# Altium schematic sheet MCU.SchDoc
size A4; SheetNumber: 4; SheetTotal: 5
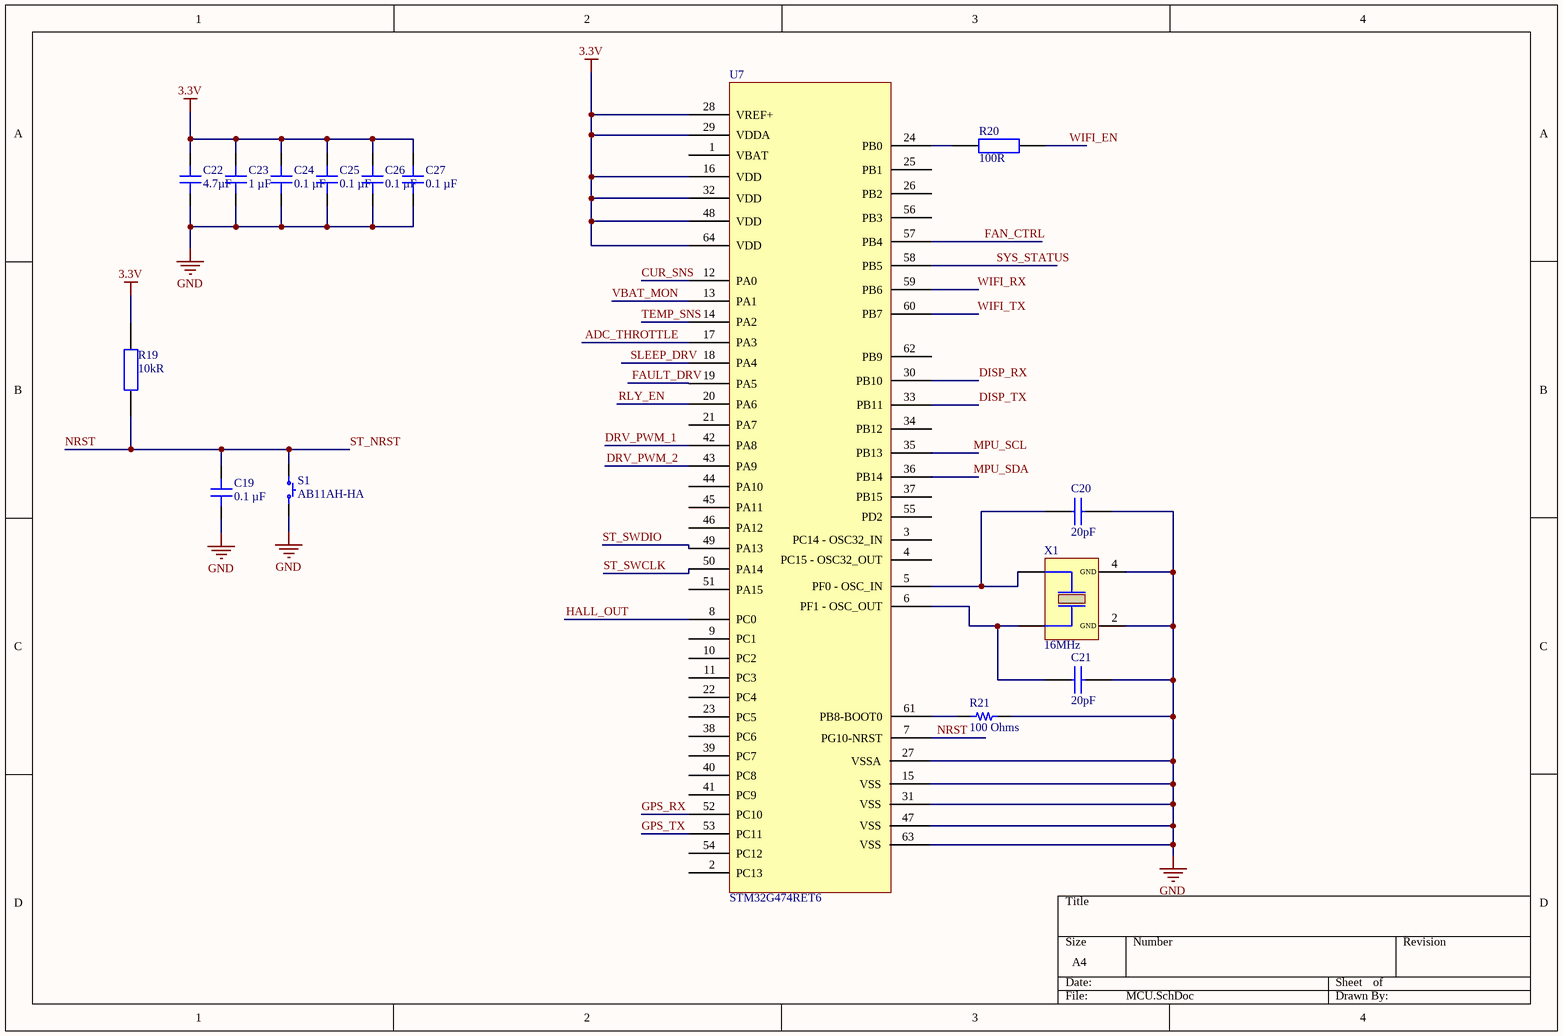
[diagram p0: MCU.SchDoc]

## Parts
C19  0.1 µF  [CAP 0603_1608]
C20  Capacitance: 20pF  [CAP_0603]  (hidden comment: CL10C200JB8NNNC)
C21  Capacitance: 20pF  [CAP_0603]  (hidden comment: CL10C200JB8NNNC)
C22  4.7µF  [CAP 0805_2012]
C23  1 µF  [CAP 0805_2012]
C24  0.1 µF  [CAP 0603_1608]
C25  0.1 µF  [CAP 0603_1608]
C26  0.1 µF  [CAP 0603_1608]
C27  0.1 µF  [CAP 0603_1608]
R19  Resistance: 10kR  [RES_0603]  (hidden comment: RC0603FR-0710KL)
R20  Resistance: 100R  [RES_0603]  (hidden comment: RC0603JR-07100RL)
R21  100 Ohms  [RES 0603_1608]
S1  AB11AH-HA  [NKK AB11AH-HA]
U7  STM32G474RET6  [STM32G474RET6]
X1  Frequency: 16MHz  [ECS]  (hidden comment: ECS-160-20-30B-TR)

## Nets
3.3V: C22.2 C23.2 C24.2 C25.2 C26.2 C27.2 R19.2 U7.16(VDD) U7.28(VREF+) U7.29(VDDA) U7.32(VDD) U7.48(VDD) U7.64(VDD)
GND: C19.1 C20.2 C21.2 C22.1 C23.1 C24.1 C25.1 C26.1 C27.1 R21.2 S1.3 U7.15(VSS) U7.27(VSSA) U7.31(VSS) U7.47(VSS) U7.63(VSS) X1.2(GND) X1.4(GND)
ADC_THROTTLE: U7.17(PA3)
CUR_SNS: U7.12(PA0)
DISP_RX: U7.30(PB10)
DISP_TX: U7.33(PB11)
DRV_PWM_1: U7.42(PA8)
DRV_PWM_2: U7.43(PA9)
FAN_CTRL: U7.57(PB4)
FAULT_DRV: U7.19(PA5)
GPS_RX: U7.52(PC10)
GPS_TX: U7.53(PC11)
HALL_OUT: U7.8(PC0)
MPU_SCL: U7.35(PB13)
MPU_SDA: U7.36(PB14)
NRST: C19.2 R19.1 S1.1 U7.7(PG10-NRST)  [also labelled ST_NRST]
RLY_EN: U7.20(PA6)
SLEEP_DRV: U7.18(PA4)
ST_SWCLK: U7.50(PA14)
ST_SWDIO: U7.49(PA13)
SYS_STATUS: U7.58(PB5)
TEMP_SNS: U7.14(PA2)
VBAT_MON: U7.13(PA1)
WIFI_EN: R20.2
WIFI_RX: U7.59(PB6)
WIFI_TX: U7.60(PB7)
NetC20_1: C20.1 U7.5(PF0_-_OSC_IN) X1.3
NetC21_1: C21.1 U7.6(PF1_-_OSC_OUT) X1.1
NetR20_1: R20.1 U7.24(PB0)
NetR21_1: R21.1 U7.61(PB8-BOOT0)

Not connected (* = marked no-connect by the designer): U7 1(VBAT) 2(PC13) 3(PC14_-_OSC32_IN) 4(PC15_-_OSC32_OUT) 9(PC1) 10(PC2) 11(PC3) 21(PA7) 22(PC4) 23(PC5) 25(PB1) 26(PB2) 34(PB12) 37(PB15) 38(PC6) 39(PC7) 40(PC8) 41(PC9) 44(PA10) 45(PA11) 46(PA12) 51(PA15) 54(PC12) 55(PD2) 56(PB3) 62(PB9)

## Library data of the parts
C19 C24-C27 = CS0603KRX7R7BB104: CAP CER 0.1UF 16V X7R 0603; manufacturer: Yageo; Tolerance: ±10%; Part Number: CS0603KRX7R7BB104; Capacitance: 0.1 µF; Applications: Boardflex Sensitive; componentlink1description: Datasheet; componentlink1url: http://www.yageo.com/NewPortal/yageodocoutput?fileName=/pdf/MLCC/UPY-ST_NPOX7R_16V-to-3KV_5.pdf; componentlink2description: DigiKey Link; componentlink2url: https://www.digikey.com/en/products/detail/yageo/CS0603KRX7R7BB104/6097897; Device Package: 0603 (1608 Metric); Features: Soft Termination; lastupdated: 9.02.2024 20:10:30; Lifecycle Status: Active; Minimum Order: 1; Mounting Type: Surface Mount, MLCC; Operating Temperature: -55°C ~ 125°C; Package / Case: 0603 (1608 Metric); packaging: TapeAndReel; partid: 2286; Part Status: Active; price: 0.01; series: CS; Size / Dimension: 0.063" L x 0.031" W (1.60mm x 0.80mm); Supplier 1: DigiKey; Supplier Part Number 1: 311-3560-1-ND; Temperature Coefficient: X7R; Thickness (Max): 0.037" (0.95mm); value: 0.1 µF; Voltage - Rated: 16V
C20 C21 = CAP CER 20pF 0603: CAP CER 20pF %5 0603 SMD; Manufacturer: Samsung; Tolerance: 5%; Dielectric: C0G; Voltage Rating: 50V; Temperature Coefficient: 300ppm/°C; Designed by: BERK; Supplier 1: Digi-Key; Manufacturer Part Number: CL10C200JB8NNNC; RoHS: Yes; Category: Ceramic Capacitors; Stock 1: 765558; Pricing 1: 1=0,10000, 10=0,04700, 50=0,02560, 100=0,02090, 500=0,01490, 1000=0,01171 (USD); Mount: Surface Mount; Case/Package: 0603; Case Code (Metric): 1608; Case Code (Imperial): 0603; Min Operating Temperature: -55°C; Max Operating Temperature: 125°C; Package Quantity: 1; Packaging: Tape and Reel; Voltage: 50V; Series: CL; Construction: Flat; Length: 1.6mm; Width: 0.031inch; Height: 0.8mm; Thickness: 0.035inch; Depth: 0.8mm; Radiation Hardening: No; RoHS Compliant: Yes; ComponentLink1URL: https://datasheet.ciiva.com/26877/getdatasheetpartid-640634-26877974.pdf?src-supplier=Verical; ComponentLink1Description: https://datasheet.ciiva.com/26877/getdatasheetpartid-640634-26877974.pdf?src-supplier=Verical; ComponentLink2URL: https://datasheet.ciiva.com/26310/mlcc-catalogdownload2013-eng-26310315.pdf?src-supplier=Distrelec; ComponentLink2Description: https://datasheet.ciiva.com/26310/mlcc-catalogdownload2013-eng-26310315.pdf?src-supplier=Distrelec; Supplier Part Number 1: 1276-1187-1-ND
C22 = 0805YD475MAT2A: CAP CER 4.7UF 16V X5R 0805; manufacturer: AVX Corporation; Tolerance: ±20%; Part Number: 0805YD475MAT2A; Capacitance: 4.7µF; Applications: General Purpose; componentlink1description: Datasheet; componentlink1url: http://datasheets.avx.com/cx5r.pdf; componentlink2description: DigiKey Link; componentlink2url: http://digikey.com/product-detail/en/avx-corporation/0805YD475MAT2A/478-6223-1-ND/2391422; Device Package: 0805 (2012 Metric); lastupdated: 2.09.2020 01:04:29; Lifecycle Status: Active; Minimum Order: 1; Mounting Type: Surface Mount, MLCC; Operating Temperature: -55°C ~ 85°C; Package / Case: 0805 (2012 Metric); packaging: TapeAndReel; partid: 9663; Part Status: Active; price: 0.19; series: -; Size / Dimension: 0.079" L x 0.049" W (2.01mm x 1.25mm); Supplier 1: DigiKey; Supplier Part Number 1: 478-6223-1-ND; Temperature Coefficient: X5R; Thickness (Max): 0.055" (1.40mm); value: 4.7µF; Voltage - Rated: 16V
C23 = EMK212B7105KGHTR: CAP CER 1UF 16V X7R 0805; manufacturer: Taiyo Yuden; Tolerance: ±10%; Part Number: EMK212B7105KGHTR; Capacitance: 1 µF; Applications: Automotive; componentlink1description: Datasheet; componentlink1url: https://ds.yuden.co.jp/TYCOMPAS/ut/detail?pn=EMK212B7105KGHTR &u=M; componentlink2description: DigiKey Link; componentlink2url: https://www.digikey.com/en/products/detail/taiyo-yuden/EMK212B7105KGHTR/6563155; Device Package: 0805 (2012 Metric); lastupdated: 9.02.2024 20:16:06; Lifecycle Status: Active; Minimum Order: 1; Mounting Type: Surface Mount, MLCC; Operating Temperature: -55°C ~ 125°C; Package / Case: 0805 (2012 Metric); packaging: TapeAndReel; partid: 3641; Part Status: Active; price: 0.03; Ratings: AEC-Q200; series: M; Size / Dimension: 0.079" L x 0.049" W (2.00mm x 1.25mm); Supplier 1: DigiKey; Supplier Part Number 1: 587-6310-1-ND; Temperature Coefficient: X7R; Thickness (Max): 0.053" (1.35mm); value: 1 µF; Voltage - Rated: 16V
R19 = RES 10K OHM 0603: RES 10K %1 OHM 0603 SMD; Manufacturer: Yageo; Designed by: BERK; Tolerance: 1%; Temperature Coefficient: 100ppm/°C; Voltage Rating (DC): 50V; Power Rating: 100mW; Voltage Rating: 75V; Supplier 1: Digi-Key; Manufacturer Part Number: RC0603FR-0710KL; RoHS: Yes; Category: Chip SMD Resistors; Stock 1: 24140601; Pricing 1: 1=0,10000, 10=0,02300, 100=0,00930, 1000=0,00417, 2500=0,00362 (USD); Case/Package: 0603; Number of Pins: 2; Case Code (Imperial): 0603; Case Code (Metric): 1608; Weight: 7.1E-05oz; Size Code: 0603; Min Operating Temperature: -55°C; Max Operating Temperature: 155°C; Resistor Type: Thick Film; Packaging: Tape and Reel; Termination: SMD/SMT; Features: Moisture Resistant; Series: RC; Max Power Dissipation: 100mW; Number of Terminations: 2; Resistance Tolerance: 1%; Construction: Rectangular; Length: 1.6mm; Width: 0.8mm; Height: 0.45mm; Depth: 0.8mm; Lead Pitch: 0.3mm; REACH SVHC: Unknown; Lead Free: Lead Free; Military Standard: Not; RoHS Compliant: Yes; ComponentLink1URL: https://datasheet.ciiva.com/7660/38590-7660789.pdf?src-supplier=Element14; ComponentLink1Description: https://datasheet.ciiva.com/7660/38590-7660789.pdf?src-supplier=Element14; ComponentLink2URL: https://datasheet.ciiva.com/15189/getdatasheetpartid-409289-15189591.pdf?src-supplier=Verical; ComponentLink2Description: https://datasheet.ciiva.com/15189/getdatasheetpartid-409289-15189591.pdf?src-supplier=Verical; ComponentLink3URL: https://datasheet.ciiva.com/46440/1868787-46440891.pdf?src-supplier=Element14; ComponentLink3Description: https://datasheet.ciiva.com/46440/1868787-46440891.pdf?src-supplier=Element14; ComponentLink4URL: https://datasheet.ciiva.com/7983/443971-7983596.pdf?src-supplier=Element14; ComponentLink4Description: https://datasheet.ciiva.com/7983/443971-7983596.pdf?src-supplier=Element14; ComponentLink5URL: https://datasheet.ciiva.com/7746/1738695-7746239.pdf?src-supplier=Element14; ComponentLink5Description: https://datasheet.ciiva.com/7746/1738695-7746239.pdf?src-supplier=Element14; ComponentLink6URL: https://datasheet.ciiva.com/22747/443971-22747519.pdf?src-supplier=Element14; ComponentLink6Description: https://datasheet.ciiva.com/22747/443971-22747519.pdf?src-supplier=Element14; Supplier Part Number 1: 311-10.0KHRCT-ND
R20 = RES 100 OHM 0603: RES 100 %5 OHM 0603 SMD; Manufacturer: Yageo; Designed by: BERK; Tolerance: 5%; Temperature Coefficient: 100ppm/°C; Voltage Rating (DC): 50V; Power Rating: 100mW; Supplier 1: Digi-Key; Manufacturer Part Number: RC0603JR-07100RL; RoHS: Yes; Category: Chip SMD Resistors; Stock 1: 4334796; Pricing 1: 1=0,10000, 10=0,01900, 100=0,00770, 1000=0,00344, 2500=0,00298 (USD); Case/Package: 0603; Number of Pins: 2; Contact Plating: Tin,Matte; Case Code (Imperial): 0603; Case Code (Metric): 1608; Size Code: 0603; Min Operating Temperature: -55°C; Max Operating Temperature: 155°C; Resistor Type: Thick Film; Packaging: Tape and Reel; Voltage Rating: 50V; Termination: SMD/SMT; Features: Moisture Resistant; Series: RC; Max Power Dissipation: 100mW; Number of Terminations: 2; Construction: Rectangular; Resistance Tolerance: 5%; Length: 1.6mm; Width: 0.8mm; Depth: 0.8mm; Radiation Hardening: No; REACH SVHC: Unknown; Lead Free: Lead Free; Military Standard: Not; RoHS Compliant: Yes; ComponentLink1URL: https://datasheet.ciiva.com/15189/getdatasheetpartid-325207-15189846.pdf?src-supplier=Verical; ComponentLink1Description: https://datasheet.ciiva.com/15189/getdatasheetpartid-325207-15189846.pdf?src-supplier=Verical; ComponentLink2URL: https://datasheet.ciiva.com/8883/pyu-rc0603-51-rohs-l-4-8883047.pdf?src-supplier=Avnet; ComponentLink2Description: https://datasheet.ciiva.com/8883/pyu-rc0603-51-rohs-l-4-8883047.pdf?src-supplier=Avnet; ComponentLink3URL: https://datasheet.ciiva.com/7746/443971-7746425.pdf?src-supplier=Element14; ComponentLink3Description: https://datasheet.ciiva.com/7746/443971-7746425.pdf?src-supplier=Element14; ComponentLink4URL: https://datasheet.ciiva.com/7746/443971-7746426.pdf?src-supplier=Element14; ComponentLink4Description: https://datasheet.ciiva.com/7746/443971-7746426.pdf?src-supplier=Element14; Supplier Part Number 1: 311-100GRCT-ND
R21 = ESR03EZPJ101: RES SMD 100 OHM 5% 1/4W 0603; Manufacturer: Rohm Semiconductor; Power (Watts): 0.25W, 1/4W; Temperature Coefficient: ±200ppm/°C; Part Number: ESR03EZPJ101; Value: 100 Ohms; ComponentLink1Description: Datasheet; ComponentLink1URL: https://www.rohm.com/datasheet/ESR01MZPF/esr-e; ComponentLink2Description: DigiKey Link; ComponentLink2URL: https://www.digikey.com/en/products/detail/rohm-semiconductor/ESR03EZPJ101/1983452; Composition: Thick Film; Device Package: 0603 (1608 Metric); Features: Automotive AEC-Q200, Pulse Withstanding; Height - Seated (Max): 0.022" (0.55mm); LastUpdated: 9.02.2024 20:43:34; Lifecycle Status: Active; Minimum Order: 1; Number of Terminations: 2; Operating Temperature: -55°C ~ 155°C; Package / Case: 0603 (1608 Metric); Packaging: TapeAndReel; PartId: 5450; Part Status: Active; Price: 0.01; Ratings: AEC-Q200; Resistance: 100 Ohms; Series: ESR; Size / Dimension: 0.063" L x 0.031" W (1.60mm x 0.80mm); Supplier 1: DigiKey; Supplier Part Number 1: RHM100DCT-ND; Supplier Device Package: 0603; Tolerance: ±5%
S1 = AB11AH-HA: SWITCH PUSH SPST-NO 0.4VA 28V; Manufacturer: NKK Switches; Actuator Type: Round, Button; Color - Actuator/Cap: Black; Current Rating (Amps): 0.4VA (AC/DC); Switch Function: Off-Mom; Part Number: AB11AH-HA; Circuit: SPST-NO; ComponentLink1Description: Datasheet; ComponentLink1URL: https://www.nkkswitches.com/pdf/Apushbuttons.pdf; ComponentLink2Description: DigiKey Link; ComponentLink2URL: //digikey.com/product-detail/en/nkk-switches/AB11AH-HA/360-2703-ND/1056050; Features: Sealed - Fully; LastUpdated: 12.12.2019 08:13:11; Lifecycle Status: 0; Minimum Order: 1; Mounting Type: Through Hole, Right Angle; Operating Temperature: -30°C ~ 85°C; Packaging: Tray; Part Status: Active; Price: 5.00; Series: AB; Supplier 1: DigiKey; Supplier Part Number 1: 360-2703-ND; Termination Style: PC Pin; Type: Standard; Voltage Rating - AC: 28V; Voltage Rating - DC: 28V
U7 = STM32G474RET6: MCU 32-bit ARM Cortex M4 RISC 512KB Flash 1.8V/2.5V/3.3V 64-Pin LQFP Tray; Manufacturer: STMicroelectronics; ADC Channels (Resolution): 26-Ch 12-Bit; Core Architecture: ARM Cortex-M4; DAC Channels (Resolution): 7-Ch 12-Bit; Data Bus Width: 32b; EEPROM Memory Size: 0B; Frequency: 170MHz; Interface: QSPI, USB; Clock Frequency: 48MHz; Max Junction Temperature (Tj): 105°C; Max Supply Current: 34mA; Max Supply Voltage: 3.6V; Min Supply Voltage: 1.71V; Number of A/D Converters: 5; Number of ADC Channels: 26; Number of D/A Converters: 3; Number of I2C Channels: 4; Number of I/Os: 9; Number of Interrupts: 16; Number of PWM Channels: 32; Number of Timers/Counters: 15; Number of UART Channels: 2; Number of USB Channels: 1; Operating Supply Voltage: 3V; Peripherals: POR; RAM Size: 128kB; Supplier: Farnell; Supplier Part Number: 3132418; Manufacturer Part Number: STM32G474RET6; RoHS: Compliant; Category: Microcontrollers; Stock: 9665; Pricing: 1=6,99, 10=5,62, 25=5,21, 50=5,14, 100=5,06, 250=4,99 (EUR); Ambient Temperature Range High: 85°C; China RoHS: Compliant; Flash Memory Size: 512kB; Height: 1.6mm; Height - Seated (Max): 1.6mm; Length: 10mm; Lifecycle Status: Production; Max Operating Temperature: 85°C; Memory Size: 512kB; Memory Format: FLASH; Min Operating Temperature: -40°C; Number of Channels: 26; Number of SPI Channels: 3; Number of Terminals: 64; Number of USART Channels: 3; REACH SVHC: Yes; Schedule B: 8542310000, 8542310000|8542310000|8542310000|8542310000|8542310000; Terminal Pitch: 500µm; Width: 10mm; ComponentLink1URL: https://datasheet.octopart.com:443/STM32G474RET6-STMicroelectronics-datasheet-181247485.pdf?src-supplier=IHS; ComponentLink1Description: https://datasheet.octopart.com:443/STM32G474RET6-STMicroelectronics-datasheet-181247485.pdf?src-supplier=IHS; ComponentLink2URL: https://datasheet.octopart.com:443/STM32G474RET6-STMicroelectronics-datasheet-144618862.pdf?src-supplier=TME; ComponentLink2Description: https://datasheet.octopart.com:443/STM32G474RET6-STMicroelectronics-datasheet-144618862.pdf?src-supplier=TME; ComponentLink3URL: https://datasheet.octopart.com:443/STM32G474RET6-STMicroelectronics-datasheet-136696182.pdf?src-supplier=Future+Electronics; ComponentLink3Description: https://datasheet.octopart.com:443/STM32G474RET6-STMicroelectronics-datasheet-136696182.pdf?src-supplier=Future+Electronics
X1 = CRYSTAL 16MHz: CRYSTAL 16.0000MHZ 20PF SMD; Manufacturer: ECS International; Designed by: BERK; Frequency Tolerance: 30ppm; ESR (Equivalent Series Resistance): 50R; Frequency Stability: 50ppm; Supplier 1: Digi-Key; Manufacturer Part Number: ECS-160-20-30B-TR; RoHS: Yes; Category: Crystals; Stock 1: 15303; Pricing 1: 1=1,33000, 10=1,26800, 50=1,23900, 100=1,06200, 500=1,03250 (USD); Mount: Surface Mount; Case/Package: SMD/SMT; Min Operating Temperature: -20°C; Max Operating Temperature: 70°C; Package Quantity: 1; Load Capacitance: 20pF; Packaging: Tape and Reel; Tolerance: 50ppm; Termination: SMD/SMT; Series: ECX-53B; Length: 0.197inch; Width: 0.126inch; Height: 0.033inch; Lead Free: Lead Free; RoHS Compliant: Yes; ComponentLink1URL: https://datasheet.ciiva.com/853/ecx-53b-853408.pdf?src-supplier=Digi-Key; ComponentLink1Description: https://datasheet.ciiva.com/853/ecx-53b-853408.pdf?src-supplier=Digi-Key; ComponentLink2URL: https://datasheet.ciiva.com/853/ecx-53b-853406.pdf?src-supplier=Digi-Key; ComponentLink2Description: https://datasheet.ciiva.com/853/ecx-53b-853406.pdf?src-supplier=Digi-Key; ComponentLink3URL: https://datasheet.ciiva.com/853/ecx-53b-853407.pdf?src-supplier=Digi-Key; ComponentLink3Description: https://datasheet.ciiva.com/853/ecx-53b-853407.pdf?src-supplier=Digi-Key; Supplier Part Number 1: XC1120CT-ND